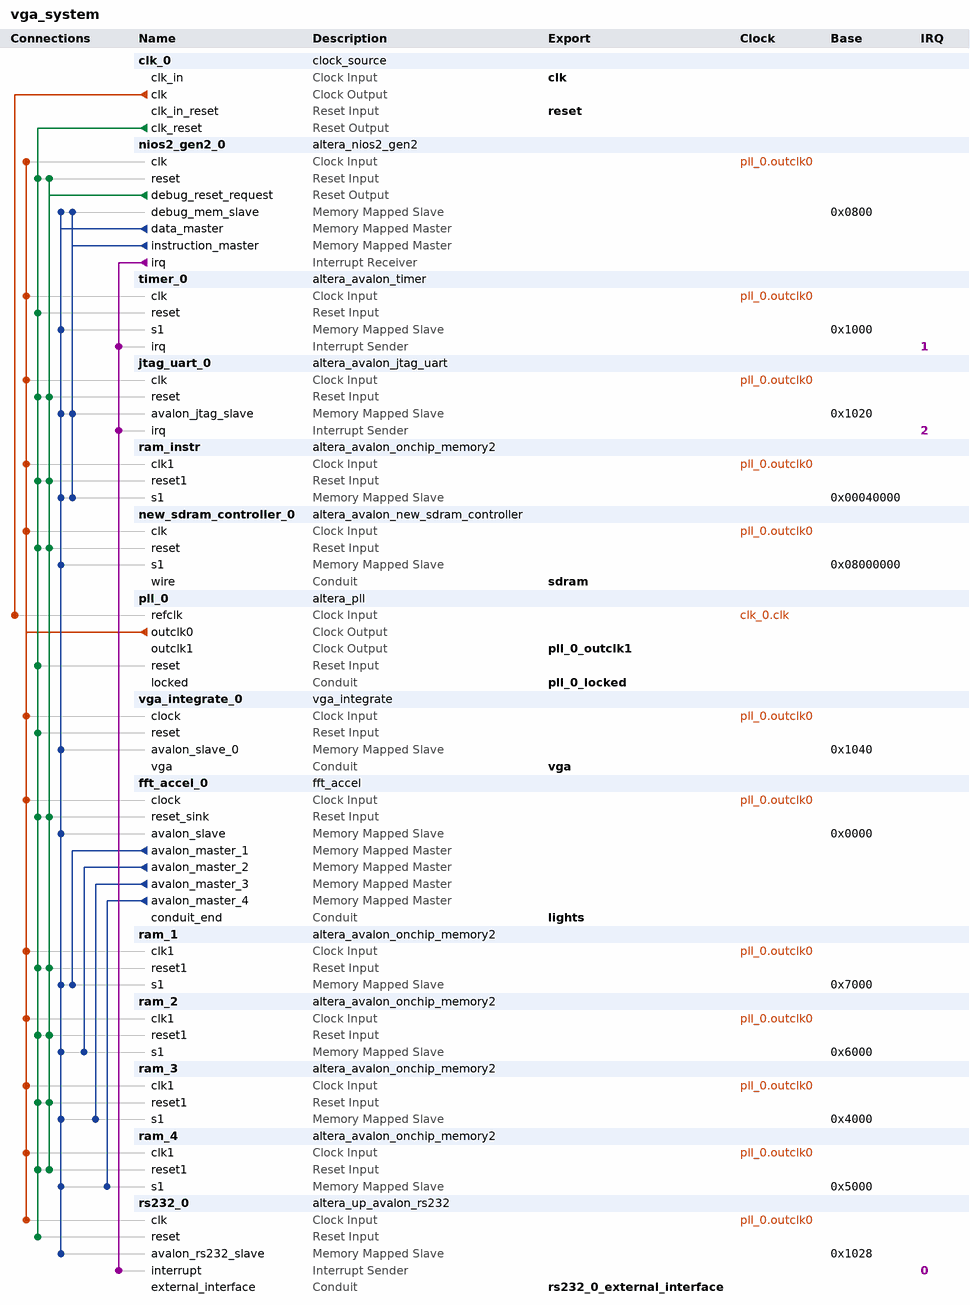
[diagram p0: system contents]
# Platform Designer (Qsys) system vga_system, Cyclone V 5CSEMA5F31C6
# Parameters at their usual value, and those the tool derives, are not listed.
package require -exact qsys 19.1
create_system vga_system
set_project_property DEVICE_FAMILY {Cyclone V}
set_project_property DEVICE 5CSEMA5F31C6

add_instance clk_0 clock_source 19.1
set_instance_parameter_value clk_0 clockFrequency 50000000

add_instance nios2_gen2_0 altera_nios2_gen2 19.1
set_instance_parameter_value nios2_gen2_0 dcache_size 2048
set_instance_parameter_value nios2_gen2_0 exceptionSlave ram_instr.s1
set_instance_parameter_value nios2_gen2_0 icache_size 4096
set_instance_parameter_value nios2_gen2_0 impl Tiny
set_instance_parameter_value nios2_gen2_0 resetSlave ram_instr.s1

add_instance timer_0 altera_avalon_timer 19.1
set_instance_parameter_value timer_0 period 50
set_instance_parameter_value timer_0 periodUnits MSEC

add_instance jtag_uart_0 altera_avalon_jtag_uart 19.1
set_instance_parameter_value jtag_uart_0 simInteractiveOptions NO_INTERACTIVE_WINDOWS

add_instance ram_instr altera_avalon_onchip_memory2 19.1
set_instance_parameter_value ram_instr dataWidth 32
set_instance_parameter_value ram_instr dualPort false
set_instance_parameter_value ram_instr initMemContent true
set_instance_parameter_value ram_instr initializationFileName onchip_mem.hex
set_instance_parameter_value ram_instr memorySize 32768

add_instance new_sdram_controller_0 altera_avalon_new_sdram_controller 19.1
set_instance_parameter_value new_sdram_controller_0 TAC 5.4
set_instance_parameter_value new_sdram_controller_0 TRCD 15.0
set_instance_parameter_value new_sdram_controller_0 TRP 15.0
set_instance_parameter_value new_sdram_controller_0 casLatency 3
set_instance_parameter_value new_sdram_controller_0 columnWidth 10
set_instance_parameter_value new_sdram_controller_0 dataWidth 16
set_instance_parameter_value new_sdram_controller_0 generateSimulationModel true
set_instance_parameter_value new_sdram_controller_0 model single_Micron_MT48LC4M32B2_7_chip
set_instance_parameter_value new_sdram_controller_0 numberOfBanks 4
set_instance_parameter_value new_sdram_controller_0 numberOfChipSelects 1
set_instance_parameter_value new_sdram_controller_0 powerUpDelay 100.0
set_instance_parameter_value new_sdram_controller_0 refreshPeriod 7.1825
set_instance_parameter_value new_sdram_controller_0 rowWidth 13

add_instance pll_0 altera_pll 19.1
set_instance_parameter_value pll_0 gui_device_speed_grade 1
set_instance_parameter_value pll_0 gui_number_of_clocks 2
set_instance_parameter_value pll_0 gui_operation_mode direct
set_instance_parameter_value pll_0 gui_output_clock_frequency0 50.0
set_instance_parameter_value pll_0 gui_output_clock_frequency1 50.0
set_instance_parameter_value pll_0 gui_phase_shift1 -3000
set_instance_parameter_value pll_0 gui_pll_mode {Integer-N PLL}
set_instance_parameter_value pll_0 gui_reference_clock_frequency 50.0
set_instance_parameter_value pll_0 gui_use_locked true

add_instance vga_integrate_0 vga_integrate 1.0

add_instance fft_accel_0 fft_accel 1.0

add_instance ram_1 altera_avalon_onchip_memory2 19.1
set_instance_parameter_value ram_1 dataWidth 32
set_instance_parameter_value ram_1 dualPort false
set_instance_parameter_value ram_1 initMemContent true
set_instance_parameter_value ram_1 initializationFileName onchip_mem.hex
set_instance_parameter_value ram_1 memorySize 4096

add_instance ram_2 altera_avalon_onchip_memory2 19.1
set_instance_parameter_value ram_2 dataWidth 32
set_instance_parameter_value ram_2 dualPort false
set_instance_parameter_value ram_2 initMemContent true
set_instance_parameter_value ram_2 initializationFileName onchip_mem.hex
set_instance_parameter_value ram_2 memorySize 4096

add_instance ram_3 altera_avalon_onchip_memory2 19.1
set_instance_parameter_value ram_3 dataWidth 32
set_instance_parameter_value ram_3 dualPort false
set_instance_parameter_value ram_3 initMemContent true
set_instance_parameter_value ram_3 initializationFileName onchip_mem.hex
set_instance_parameter_value ram_3 memorySize 4096

add_instance ram_4 altera_avalon_onchip_memory2 19.1
set_instance_parameter_value ram_4 dataWidth 32
set_instance_parameter_value ram_4 dualPort false
set_instance_parameter_value ram_4 initMemContent true
set_instance_parameter_value ram_4 initializationFileName onchip_mem.hex
set_instance_parameter_value ram_4 memorySize 4096

add_instance rs232_0 altera_up_avalon_rs232 17.1
set_instance_parameter_value rs232_0 baud 115200
set_instance_parameter_value rs232_0 parity None

# connections
add_connection clk_0.clk pll_0.refclk clock
add_connection pll_0.outclk0 fft_accel_0.clock clock
add_connection pll_0.outclk0 jtag_uart_0.clk clock
add_connection pll_0.outclk0 new_sdram_controller_0.clk clock
add_connection pll_0.outclk0 nios2_gen2_0.clk clock
add_connection pll_0.outclk0 ram_1.clk1 clock
add_connection pll_0.outclk0 ram_2.clk1 clock
add_connection pll_0.outclk0 ram_3.clk1 clock
add_connection pll_0.outclk0 ram_4.clk1 clock
add_connection pll_0.outclk0 ram_instr.clk1 clock
add_connection pll_0.outclk0 rs232_0.clk clock
add_connection pll_0.outclk0 timer_0.clk clock
add_connection pll_0.outclk0 vga_integrate_0.clock clock
add_connection clk_0.clk_reset fft_accel_0.reset_sink reset
add_connection clk_0.clk_reset jtag_uart_0.reset reset
add_connection clk_0.clk_reset new_sdram_controller_0.reset reset
add_connection clk_0.clk_reset nios2_gen2_0.reset reset
add_connection clk_0.clk_reset pll_0.reset reset
add_connection clk_0.clk_reset ram_1.reset1 reset
add_connection clk_0.clk_reset ram_2.reset1 reset
add_connection clk_0.clk_reset ram_3.reset1 reset
add_connection clk_0.clk_reset ram_4.reset1 reset
add_connection clk_0.clk_reset ram_instr.reset1 reset
add_connection clk_0.clk_reset rs232_0.reset reset
add_connection clk_0.clk_reset timer_0.reset reset
add_connection clk_0.clk_reset vga_integrate_0.reset reset
add_connection nios2_gen2_0.debug_reset_request fft_accel_0.reset_sink reset
add_connection nios2_gen2_0.debug_reset_request jtag_uart_0.reset reset
add_connection nios2_gen2_0.debug_reset_request new_sdram_controller_0.reset reset
add_connection nios2_gen2_0.debug_reset_request nios2_gen2_0.reset reset
add_connection nios2_gen2_0.debug_reset_request ram_1.reset1 reset
add_connection nios2_gen2_0.debug_reset_request ram_2.reset1 reset
add_connection nios2_gen2_0.debug_reset_request ram_3.reset1 reset
add_connection nios2_gen2_0.debug_reset_request ram_4.reset1 reset
add_connection nios2_gen2_0.debug_reset_request ram_instr.reset1 reset
add_connection fft_accel_0.avalon_master_1 ram_1.s1 avalon
set_connection_parameter_value fft_accel_0.avalon_master_1/ram_1.s1 baseAddress 0x7000
add_connection fft_accel_0.avalon_master_2 ram_2.s1 avalon
set_connection_parameter_value fft_accel_0.avalon_master_2/ram_2.s1 baseAddress 0x6000
add_connection fft_accel_0.avalon_master_3 ram_3.s1 avalon
set_connection_parameter_value fft_accel_0.avalon_master_3/ram_3.s1 baseAddress 0x4000
add_connection fft_accel_0.avalon_master_4 ram_4.s1 avalon
set_connection_parameter_value fft_accel_0.avalon_master_4/ram_4.s1 baseAddress 0x5000
add_connection nios2_gen2_0.data_master fft_accel_0.avalon_slave avalon
set_connection_parameter_value nios2_gen2_0.data_master/fft_accel_0.avalon_slave baseAddress 0x0000
add_connection nios2_gen2_0.data_master jtag_uart_0.avalon_jtag_slave avalon
set_connection_parameter_value nios2_gen2_0.data_master/jtag_uart_0.avalon_jtag_slave baseAddress 0x1020
add_connection nios2_gen2_0.data_master new_sdram_controller_0.s1 avalon
set_connection_parameter_value nios2_gen2_0.data_master/new_sdram_controller_0.s1 baseAddress 0x08000000
add_connection nios2_gen2_0.data_master nios2_gen2_0.debug_mem_slave avalon
set_connection_parameter_value nios2_gen2_0.data_master/nios2_gen2_0.debug_mem_slave baseAddress 0x0800
add_connection nios2_gen2_0.data_master ram_1.s1 avalon
set_connection_parameter_value nios2_gen2_0.data_master/ram_1.s1 baseAddress 0x7000
add_connection nios2_gen2_0.data_master ram_2.s1 avalon
set_connection_parameter_value nios2_gen2_0.data_master/ram_2.s1 baseAddress 0x6000
add_connection nios2_gen2_0.data_master ram_3.s1 avalon
set_connection_parameter_value nios2_gen2_0.data_master/ram_3.s1 baseAddress 0x4000
add_connection nios2_gen2_0.data_master ram_4.s1 avalon
set_connection_parameter_value nios2_gen2_0.data_master/ram_4.s1 baseAddress 0x5000
add_connection nios2_gen2_0.data_master ram_instr.s1 avalon
set_connection_parameter_value nios2_gen2_0.data_master/ram_instr.s1 baseAddress 0x00040000
add_connection nios2_gen2_0.data_master rs232_0.avalon_rs232_slave avalon
set_connection_parameter_value nios2_gen2_0.data_master/rs232_0.avalon_rs232_slave baseAddress 0x1028
add_connection nios2_gen2_0.data_master timer_0.s1 avalon
set_connection_parameter_value nios2_gen2_0.data_master/timer_0.s1 baseAddress 0x1000
add_connection nios2_gen2_0.data_master vga_integrate_0.avalon_slave_0 avalon
set_connection_parameter_value nios2_gen2_0.data_master/vga_integrate_0.avalon_slave_0 baseAddress 0x1040
add_connection nios2_gen2_0.instruction_master jtag_uart_0.avalon_jtag_slave avalon
set_connection_parameter_value nios2_gen2_0.instruction_master/jtag_uart_0.avalon_jtag_slave baseAddress 0x1020
add_connection nios2_gen2_0.instruction_master nios2_gen2_0.debug_mem_slave avalon
set_connection_parameter_value nios2_gen2_0.instruction_master/nios2_gen2_0.debug_mem_slave baseAddress 0x0800
add_connection nios2_gen2_0.instruction_master ram_instr.s1 avalon
set_connection_parameter_value nios2_gen2_0.instruction_master/ram_instr.s1 baseAddress 0x00040000
add_connection nios2_gen2_0.irq jtag_uart_0.irq interrupt
set_connection_parameter_value nios2_gen2_0.irq/jtag_uart_0.irq irqNumber 2
add_connection nios2_gen2_0.irq rs232_0.interrupt interrupt
set_connection_parameter_value nios2_gen2_0.irq/rs232_0.interrupt irqNumber 0
add_connection nios2_gen2_0.irq timer_0.irq interrupt
set_connection_parameter_value nios2_gen2_0.irq/timer_0.irq irqNumber 1

# exported interfaces
add_interface clk clock sink
set_interface_property clk EXPORT_OF clk_0.clk_in
add_interface lights conduit end
set_interface_property lights EXPORT_OF fft_accel_0.conduit_end
add_interface pll_0_locked conduit end
set_interface_property pll_0_locked EXPORT_OF pll_0.locked
add_interface pll_0_outclk1 clock source
set_interface_property pll_0_outclk1 EXPORT_OF pll_0.outclk1
add_interface reset reset sink
set_interface_property reset EXPORT_OF clk_0.clk_in_reset
add_interface rs232_0_external_interface conduit end
set_interface_property rs232_0_external_interface EXPORT_OF rs232_0.external_interface
add_interface sdram conduit end
set_interface_property sdram EXPORT_OF new_sdram_controller_0.wire
add_interface vga conduit end
set_interface_property vga EXPORT_OF vga_integrate_0.vga

set_interconnect_requirement {$system} qsys_mm.clockCrossingAdapter HANDSHAKE
set_interconnect_requirement {$system} qsys_mm.enableEccProtection FALSE
set_interconnect_requirement {$system} qsys_mm.insertDefaultSlave FALSE
set_interconnect_requirement {$system} qsys_mm.maxAdditionalLatency 1

save_system vga_system.qsys
